# Altium schematic sheet fpga30-serdes-power.SchDoc
size Tabloid; SheetNumber: 53; SheetTotal: 71
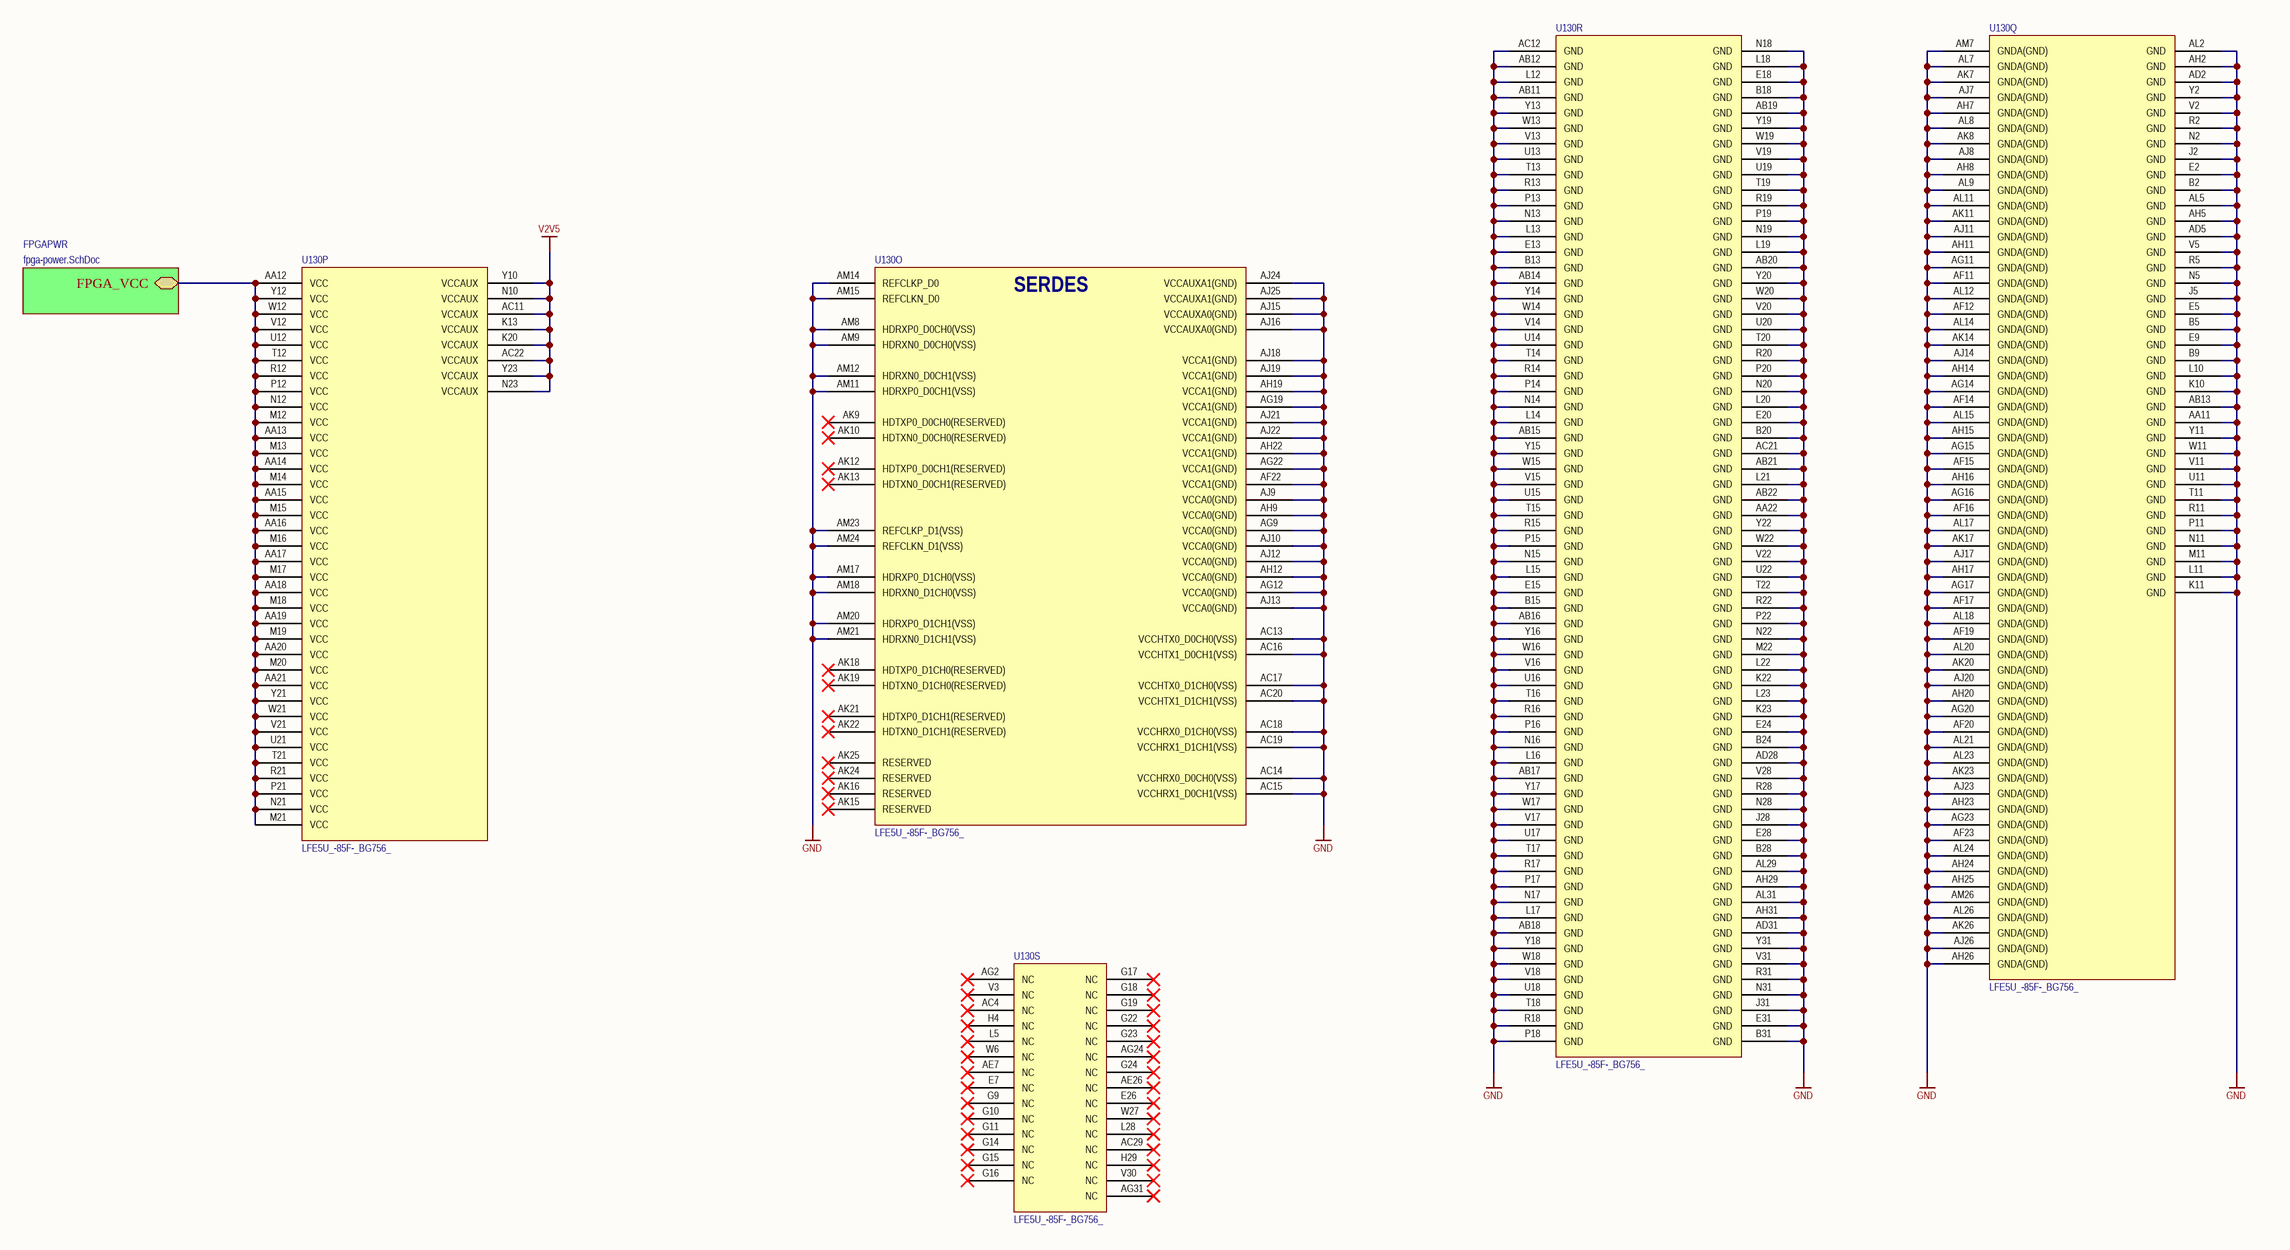
[diagram p0: fpga30-serdes-power.SchDoc]

## Parts
U130  LFE5U_-85F-_BG756_  [caBGA756]  (parts O,P,Q,R,S of 19)

## Sub-sheets
FPGAPWR = fpga-power.SchDoc: FPGA_VCC

## Nets
GND: U130.AA11(GND) U130.AA22(GND) U130.AB11(GND) U130.AB12(GND) U130.AB13(GND) U130.AB14(GND) U130.AB15(GND) U130.AB16(GND) U130.AB17(GND) U130.AB18(GND) U130.AB19(GND) U130.AB20(GND) U130.AB21(GND) U130.AB22(GND) U130.AC12(GND) U130.AC13(VCCHTX0_D0CH0(VSS)) U130.AC14(VCCHRX0_D0CH0(VSS)) U130.AC15(VCCHRX1_D0CH1(VSS)) U130.AC16(VCCHTX1_D0CH1(VSS)) U130.AC17(VCCHTX0_D1CH0(VSS)) U130.AC18(VCCHRX0_D1CH0(VSS)) U130.AC19(VCCHRX1_D1CH1(VSS)) U130.AC20(VCCHTX1_D1CH1(VSS)) U130.AC21(GND) U130.AD2(GND) U130.AD5(GND) U130.AD28(GND) U130.AD31(GND) U130.AF11(GNDA(GND)) U130.AF12(GNDA(GND)) U130.AF14(GNDA(GND)) U130.AF15(GNDA(GND)) U130.AF16(GNDA(GND)) U130.AF17(GNDA(GND)) U130.AF19(GNDA(GND)) U130.AF20(GNDA(GND)) U130.AF22(VCCA1(GND)) U130.AF23(GNDA(GND)) U130.AG9(VCCA0(GND)) U130.AG11(GNDA(GND)) U130.AG12(VCCA0(GND)) U130.AG14(GNDA(GND)) U130.AG15(GNDA(GND)) U130.AG16(GNDA(GND)) U130.AG17(GNDA(GND)) U130.AG19(VCCA1(GND)) U130.AG20(GNDA(GND)) U130.AG22(VCCA1(GND)) U130.AG23(GNDA(GND)) U130.AH2(GND) U130.AH5(GND) U130.AH7(GNDA(GND)) U130.AH8(GNDA(GND)) U130.AH9(VCCA0(GND)) U130.AH11(GNDA(GND)) U130.AH12(VCCA0(GND)) U130.AH14(GNDA(GND)) U130.AH15(GNDA(GND)) U130.AH16(GNDA(GND)) U130.AH17(GNDA(GND)) U130.AH19(VCCA1(GND)) U130.AH20(GNDA(GND)) U130.AH22(VCCA1(GND)) U130.AH23(GNDA(GND)) U130.AH24(GNDA(GND)) U130.AH25(GNDA(GND)) U130.AH26(GNDA(GND)) U130.AH29(GND) U130.AH31(GND) U130.AJ7(GNDA(GND)) U130.AJ8(GNDA(GND)) U130.AJ9(VCCA0(GND)) U130.AJ10(VCCA0(GND)) U130.AJ11(GNDA(GND)) U130.AJ12(VCCA0(GND)) U130.AJ13(VCCA0(GND)) U130.AJ14(GNDA(GND)) U130.AJ15(VCCAUXA0(GND)) U130.AJ16(VCCAUXA0(GND)) U130.AJ17(GNDA(GND)) U130.AJ18(VCCA1(GND)) U130.AJ19(VCCA1(GND)) U130.AJ20(GNDA(GND)) U130.AJ21(VCCA1(GND)) U130.AJ22(VCCA1(GND)) U130.AJ23(GNDA(GND)) U130.AJ24(VCCAUXA1(GND)) U130.AJ25(VCCAUXA1(GND)) U130.AJ26(GNDA(GND)) U130.AK7(GNDA(GND)) U130.AK8(GNDA(GND)) U130.AK11(GNDA(GND)) U130.AK14(GNDA(GND)) U130.AK17(GNDA(GND)) U130.AK20(GNDA(GND)) U130.AK23(GNDA(GND)) U130.AK26(GNDA(GND)) U130.AL2(GND) U130.AL5(GND) U130.AL7(GNDA(GND)) U130.AL8(GNDA(GND)) U130.AL9(GNDA(GND)) U130.AL11(GNDA(GND)) U130.AL12(GNDA(GND)) U130.AL14(GNDA(GND)) U130.AL15(GNDA(GND)) U130.AL17(GNDA(GND)) U130.AL18(GNDA(GND)) U130.AL20(GNDA(GND)) U130.AL21(GNDA(GND)) U130.AL23(GNDA(GND)) U130.AL24(GNDA(GND)) U130.AL26(GNDA(GND)) U130.AL29(GND) U130.AL31(GND) U130.AM7(GNDA(GND)) U130.AM8(HDRXP0_D0CH0(VSS)) U130.AM9(HDRXN0_D0CH0(VSS)) U130.AM11(HDRXP0_D0CH1(VSS)) U130.AM12(HDRXN0_D0CH1(VSS)) U130.AM14(REFCLKP_D0) U130.AM15(REFCLKN_D0) U130.AM17(HDRXP0_D1CH0(VSS)) U130.AM18(HDRXN0_D1CH0(VSS)) U130.AM20(HDRXP0_D1CH1(VSS)) U130.AM21(HDRXN0_D1CH1(VSS)) U130.AM23(REFCLKP_D1(VSS)) U130.AM24(REFCLKN_D1(VSS)) U130.AM26(GNDA(GND)) U130.B2(GND) U130.B5(GND) U130.B9(GND) U130.B13(GND) U130.B15(GND) U130.B18(GND) U130.B20(GND) U130.B24(GND) U130.B28(GND) U130.B31(GND) U130.E2(GND) U130.E5(GND) U130.E9(GND) U130.E13(GND) U130.E15(GND) U130.E18(GND) U130.E20(GND) U130.E24(GND) U130.E28(GND) U130.E31(GND) U130.J2(GND) U130.J5(GND) U130.J28(GND) U130.J31(GND) U130.K10(GND) U130.K11(GND) U130.K22(GND) U130.K23(GND) U130.L10(GND) U130.L11(GND) U130.L12(GND) U130.L13(GND) U130.L14(GND) U130.L15(GND) U130.L16(GND) U130.L17(GND) U130.L18(GND) U130.L19(GND) U130.L20(GND) U130.L21(GND) U130.L22(GND) U130.L23(GND) U130.M11(GND) U130.M22(GND) U130.N2(GND) U130.N5(GND) U130.N11(GND) U130.N13(GND) U130.N14(GND) U130.N15(GND) U130.N16(GND) U130.N17(GND) U130.N18(GND) U130.N19(GND) U130.N20(GND) U130.N22(GND) U130.N28(GND) U130.N31(GND) U130.P11(GND) U130.P13(GND) U130.P14(GND) U130.P15(GND) U130.P16(GND) U130.P17(GND) U130.P18(GND) U130.P19(GND) U130.P20(GND) U130.P22(GND) U130.R2(GND) U130.R5(GND) U130.R11(GND) U130.R13(GND) U130.R14(GND) U130.R15(GND) U130.R16(GND) U130.R17(GND) U130.R18(GND) U130.R19(GND) U130.R20(GND) U130.R22(GND) U130.R28(GND) U130.R31(GND) U130.T11(GND) U130.T13(GND) U130.T14(GND) U130.T15(GND) U130.T16(GND) U130.T17(GND) U130.T18(GND) U130.T19(GND) U130.T20(GND) U130.T22(GND) U130.U11(GND) U130.U13(GND) U130.U14(GND) U130.U15(GND) U130.U16(GND) U130.U17(GND) U130.U18(GND) U130.U19(GND) U130.U20(GND) U130.U22(GND) U130.V2(GND) U130.V5(GND) U130.V11(GND) U130.V13(GND) U130.V14(GND) U130.V15(GND) U130.V16(GND) U130.V17(GND) U130.V18(GND) U130.V19(GND) U130.V20(GND) U130.V22(GND) U130.V28(GND) U130.V31(GND) U130.W11(GND) U130.W13(GND) U130.W14(GND) U130.W15(GND) U130.W16(GND) U130.W17(GND) U130.W18(GND) U130.W19(GND) U130.W20(GND) U130.W22(GND) U130.Y2(GND) U130.Y11(GND) U130.Y13(GND) U130.Y14(GND) U130.Y15(GND) U130.Y16(GND) U130.Y17(GND) U130.Y18(GND) U130.Y19(GND) U130.Y20(GND) U130.Y22(GND) U130.Y31(GND)
V2V5: U130.AC11(VCCAUX) U130.AC22(VCCAUX) U130.K13(VCCAUX) U130.K20(VCCAUX) U130.N10(VCCAUX) U130.N23(VCCAUX) U130.Y10(VCCAUX) U130.Y23(VCCAUX)
NetU130_AA12: U130.AA12(VCC) U130.AA13(VCC) U130.AA14(VCC) U130.AA15(VCC) U130.AA16(VCC) U130.AA17(VCC) U130.AA18(VCC) U130.AA19(VCC) U130.AA20(VCC) U130.AA21(VCC) U130.M12(VCC) U130.M13(VCC) U130.M14(VCC) U130.M15(VCC) U130.M16(VCC) U130.M17(VCC) U130.M18(VCC) U130.M19(VCC) U130.M20(VCC) U130.M21(VCC) U130.N12(VCC) U130.N21(VCC) U130.P12(VCC) U130.P21(VCC) U130.R12(VCC) U130.R21(VCC) U130.T12(VCC) U130.T21(VCC) U130.U12(VCC) U130.U21(VCC) U130.V12(VCC) U130.V21(VCC) U130.W12(VCC) U130.W21(VCC) U130.Y12(VCC) U130.Y21(VCC) ; sheet FPGAPWR/FPGA_VCC

Not connected (* = marked no-connect by the designer): U130 AC4(NC)* AC29(NC)* AE7(NC)* AE26(NC)* AG2(NC)* AG24(NC)* AG31(NC)* AK9(HDTXP0_D0CH0(RESERVED))* AK10(HDTXN0_D0CH0(RESERVED))* AK12(HDTXP0_D0CH1(RESERVED))* AK13(HDTXN0_D0CH1(RESERVED))* AK15(RESERVED)* AK16(RESERVED)* AK18(HDTXP0_D1CH0(RESERVED))* AK19(HDTXN0_D1CH0(RESERVED))* AK21(HDTXP0_D1CH1(RESERVED))* AK22(HDTXN0_D1CH1(RESERVED))* AK24(RESERVED)* AK25(RESERVED)* E7(NC)* E26(NC)* G9(NC)* G10(NC)* G11(NC)* G14(NC)* G15(NC)* G16(NC)* G17(NC)* G18(NC)* G19(NC)* G22(NC)* G23(NC)* G24(NC)* H4(NC)* H29(NC)* L5(NC)* L28(NC)* V3(NC)* V30(NC)* W6(NC)* W27(NC)*

## Notes on the sheet
- (in symbol LFE5U_-85F-_BG756_, part O) SERDES

## Library data of the parts
U130 = LFE5U_-85F-_BG756_: ECP5 FPGA, 85k LUT, 756-caBGA; Manufacturer: Lattice Semiconductor; Manufacturer P/N: LFE5U_-85F-_BG756_